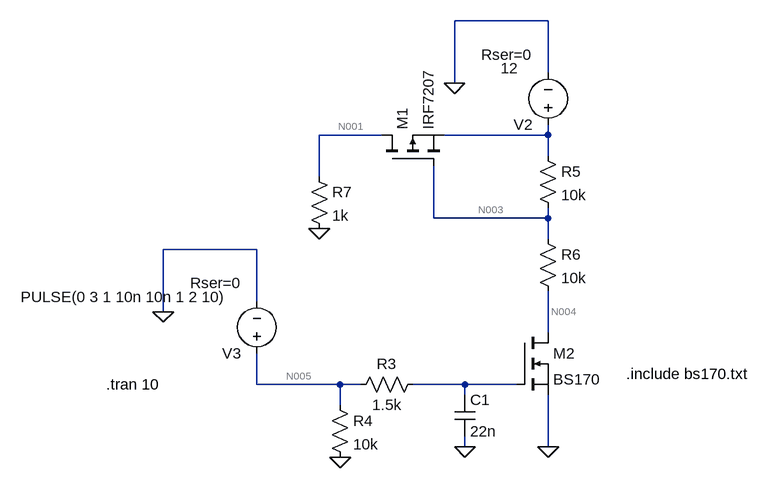
[diagram p0: schematic BS170 PMOS Power Switch.asc]
BS170 PMOS Power Switch.asc, the LTspice schematic file:
Version 4
SHEET 1 3764 1240
WIRE -2304 -3488 -2448 -3488
WIRE -2304 -3408 -2304 -3488
WIRE -2448 -3392 -2448 -3488
WIRE -2560 -3312 -2656 -3312
WIRE -2304 -3312 -2304 -3328
WIRE -2304 -3312 -2464 -3312
WIRE -2304 -3280 -2304 -3312
WIRE -2656 -3248 -2656 -3312
WIRE -2480 -3184 -2480 -3264
WIRE -2304 -3184 -2304 -3200
WIRE -2304 -3184 -2480 -3184
WIRE -2304 -3152 -2304 -3184
WIRE -2752 -3136 -2896 -3136
WIRE -2752 -3056 -2752 -3136
WIRE -2896 -3040 -2896 -3136
WIRE -2304 -3008 -2304 -3072
WIRE -2752 -2928 -2752 -2976
WIRE -2624 -2928 -2752 -2928
WIRE -2592 -2928 -2624 -2928
WIRE -2432 -2928 -2512 -2928
WIRE -2352 -2928 -2432 -2928
WIRE -2432 -2912 -2432 -2928
WIRE -2624 -2896 -2624 -2928
WIRE -2432 -2832 -2432 -2848
WIRE -2304 -2832 -2304 -2912
FLAG -2304 -2832 0
FLAG -2624 -2816 0
FLAG -2448 -3392 0
FLAG -2896 -3040 0
FLAG -2656 -3168 0
FLAG -2432 -2832 0
SYMBOL nmos -2352 -3008 R0
SYMATTR InstName M2
SYMATTR Value BS170
SYMATTR Prefix X
SYMBOL res -2496 -2944 R90
WINDOW 0 0 56 VBottom 2
WINDOW 3 32 56 VTop 2
SYMATTR InstName R3
SYMATTR Value 1.5k
SYMBOL res -2640 -2912 R0
SYMATTR InstName R4
SYMATTR Value 10k
SYMBOL voltage -2304 -3312 R180
WINDOW 123 0 0 Left 0
WINDOW 39 24 124 Left 2
WINDOW 3 46 103 Left 2
SYMATTR SpiceLine Rser=0
SYMATTR Value 12
SYMATTR InstName V2
SYMBOL res -2320 -3296 R0
SYMATTR InstName R5
SYMATTR Value 10k
SYMBOL res -2320 -3168 R0
SYMATTR InstName R6
SYMATTR Value 10k
SYMBOL voltage -2752 -2960 R180
WINDOW 123 0 0 Left 0
WINDOW 39 24 124 Left 2
WINDOW 3 46 103 Left 2
SYMATTR SpiceLine Rser=0
SYMATTR Value PULSE(0 3 1 10n 10n 1 2 10)
SYMATTR InstName V3
SYMBOL pmos -2560 -3264 R270
SYMATTR InstName M1
SYMATTR Value IRF7207
SYMBOL res -2672 -3264 R0
SYMATTR InstName R7
SYMATTR Value 1k
SYMBOL cap -2448 -2912 R0
SYMATTR InstName C1
SYMATTR Value 22n
TEXT -2184 -2944 Left 2 !.include bs170.txt
TEXT -2984 -2928 Left 2 !.tran 10

The netlist it stands for:
* BS170 PMOS Power Switch.asc
XM2 N004 N006 0 BS170  ; pins D G S
R3 N006 N005 1.5k
R4 N005 0 10k
V2 N002 0 12 Rser=0
R5 N002 N003 10k
R6 N003 N004 10k
V3 N005 0 PULSE(0 3 1 10n 10n 1 2 10) Rser=0
M1 N001 N003 N002 N002 IRF7207
R7 N001 0 1k
C1 N006 0 22n
.model NMOS NMOS
.model PMOS PMOS
.lib standard.mos
.include bs170.txt
.tran 10
.backanno
.end

* Results of the author's LTspice run, read from the files saved beside the schematic
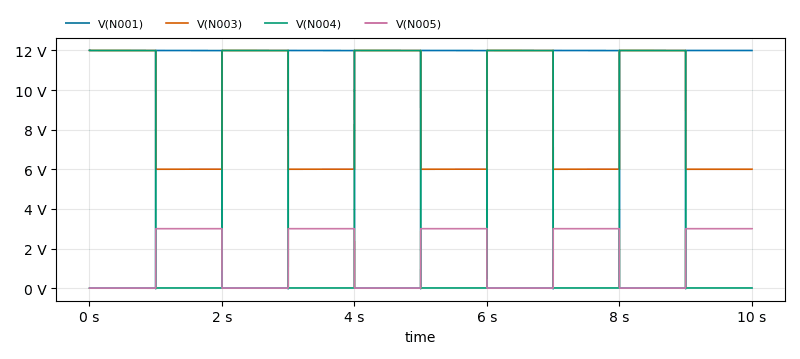
[diagram p1: Transient Analysis of BS170 PMOS Power Switch.asc, plotted from the saved traces]
* Transient Analysis, 1 run:
*   V(N001): min -35.08 mV, max 12 V, average 6 V, rms 8.485 V, last 12 V
*   V(N003): min 6.003 V, max 12 V, average 9.002 V, rms 9.488 V, last 6.003 V
*   V(N004): min 6.664 mV, max 12.01 V, average 6.003 V, rms 8.485 V, last 6.691 mV
*   V(N005): min 0 V, max 3 V, average 1.5 V, rms 2.121 V, last 3 V